# EasyEDA Pro project ProPrj_四路电机电源板_2025-10-18.epro

# Schematic Schematic1
Board Name: Board1; Create Date: 2025-07-10; Page Name: P1; Project Name: 四路电机电源板; Schematic Name: Schematic1; Update Date: 2025-07-10; Company: 嘉立创EDA; Page Size: A4; Version: V1.0
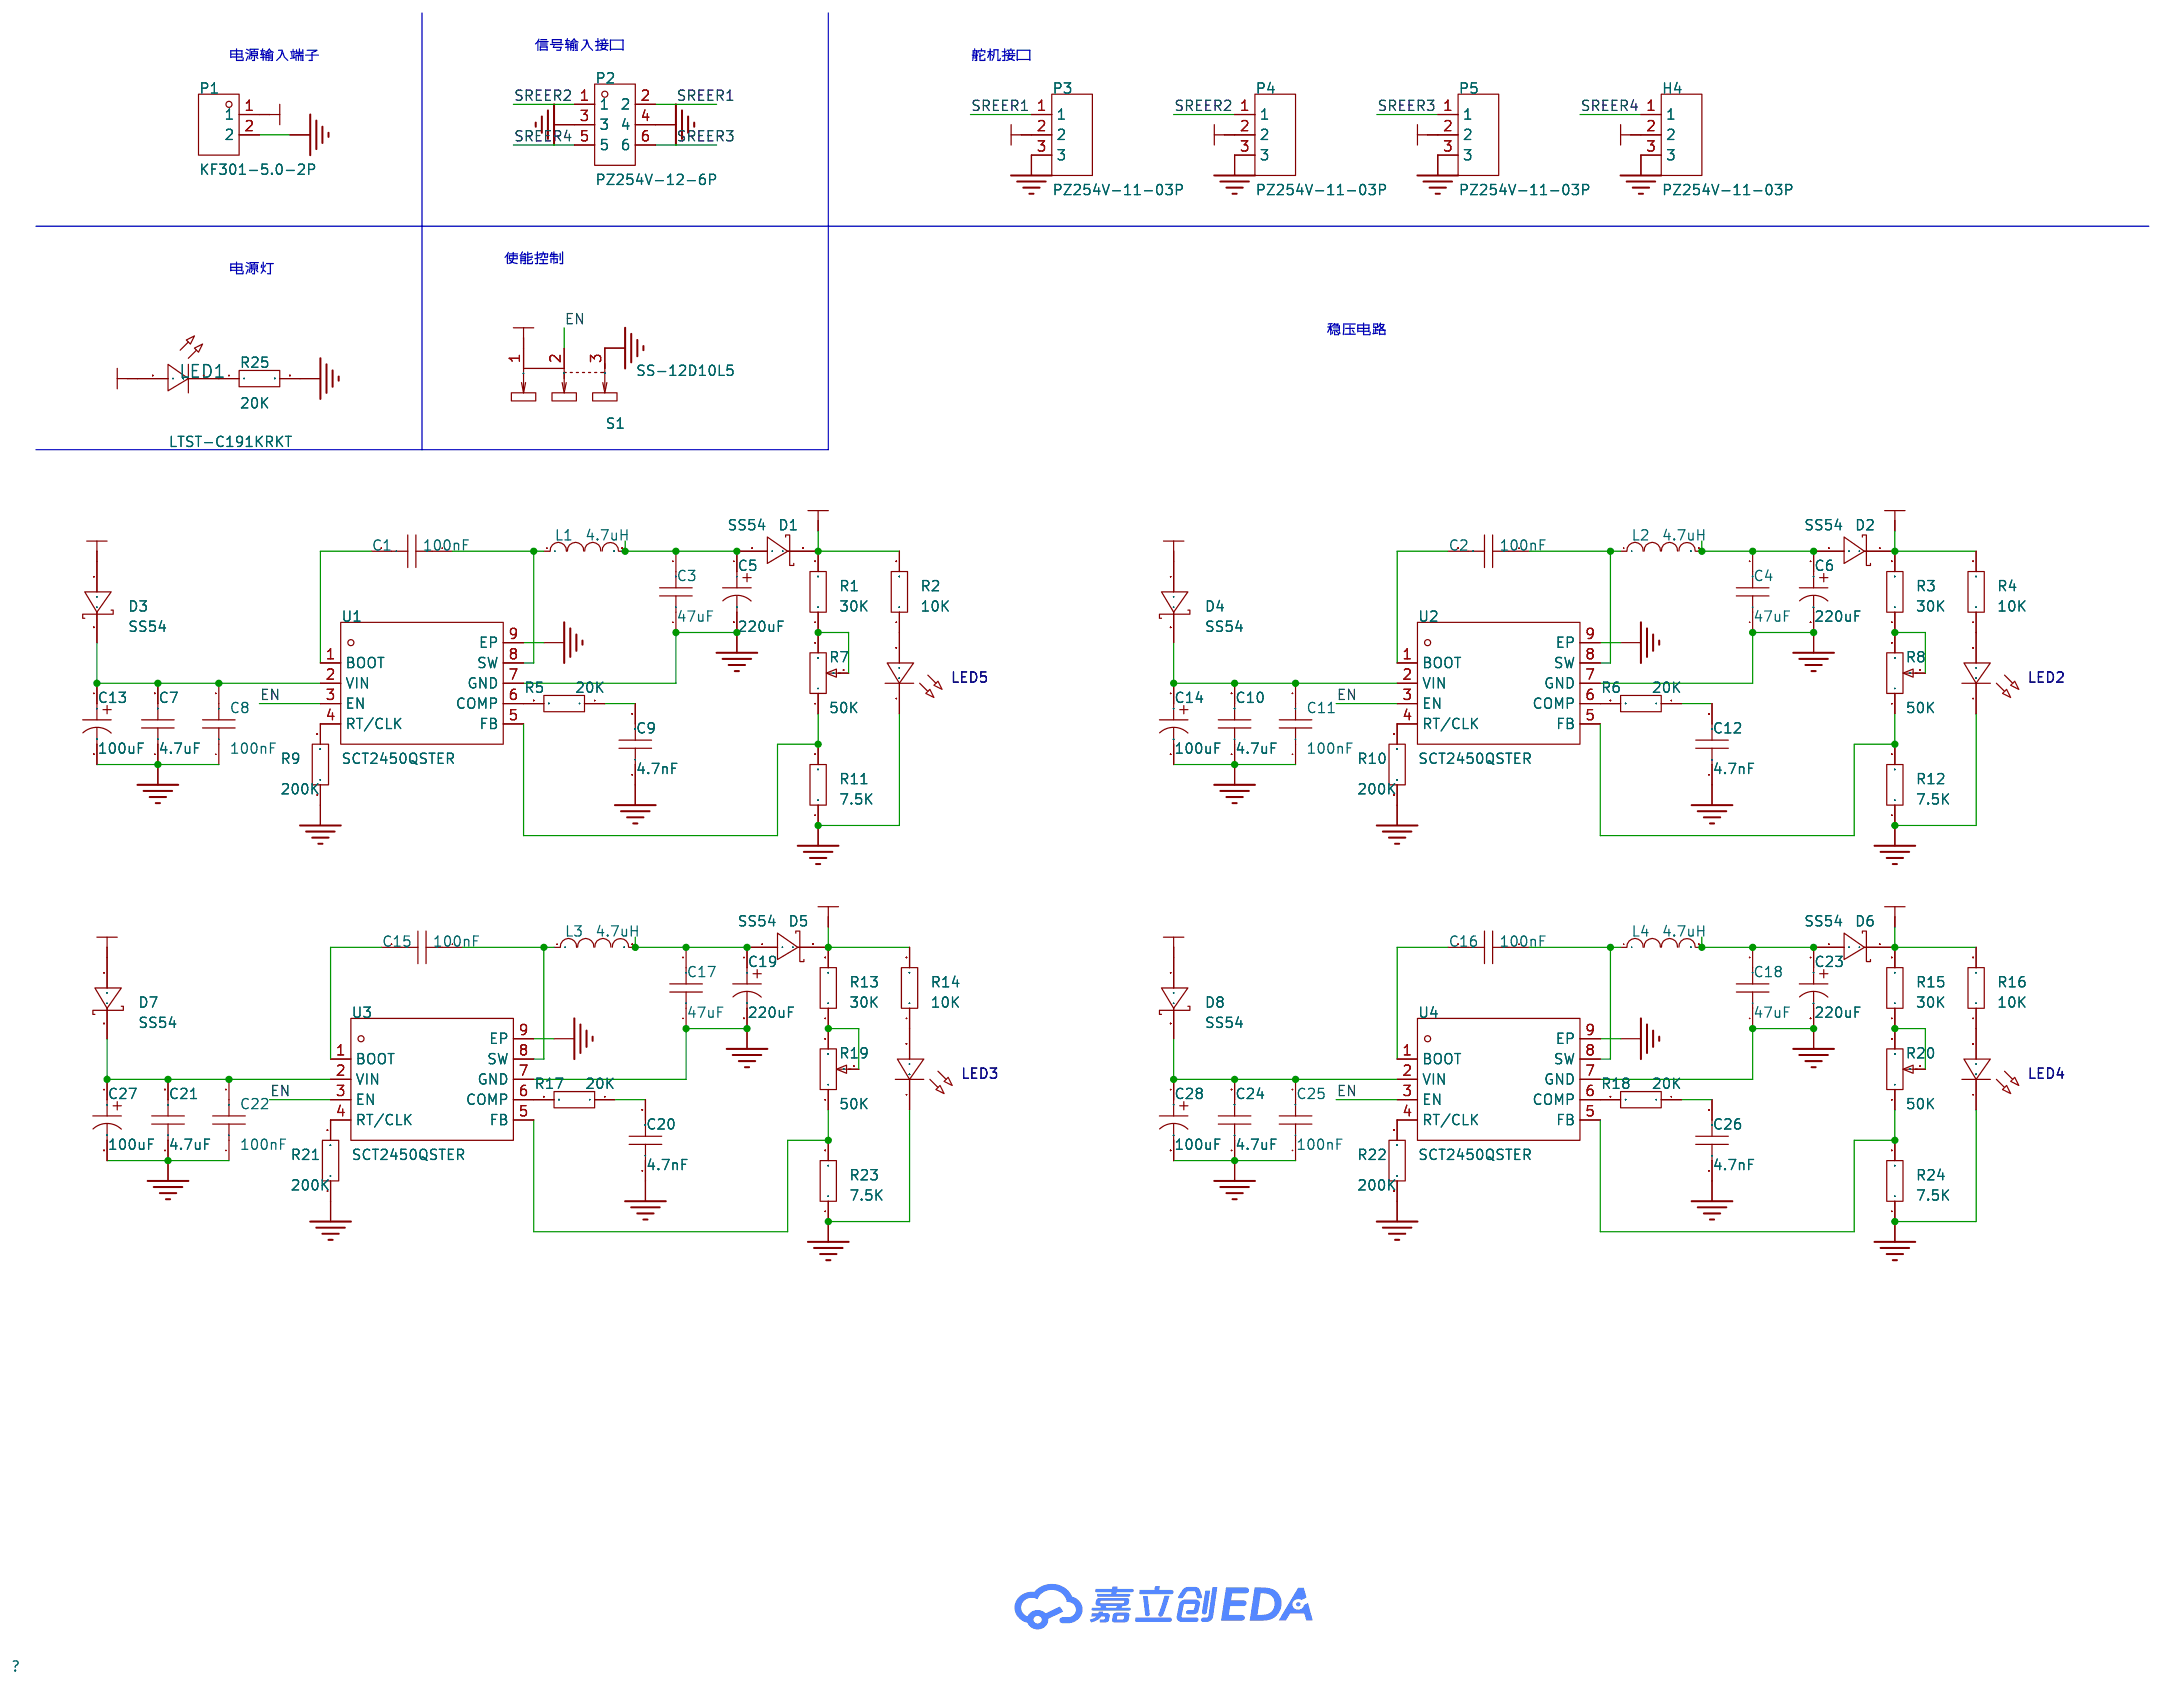
[diagram p0: schematic sheet]

## Parts
C1  100nF  [C0603]
C2  100nF  [C0603]
C3  47uF  [C1206]
C4  47uF  [C1206]
C5  220uF  [CAP-SMD_BD6.3-L6.6-W6.6-LS7.2-FD]
C6  220uF  [CAP-SMD_BD6.3-L6.6-W6.6-LS7.2-FD]
C7  4.7uF  [C1206]
C8  100nF  [C0603]
C9  4.7nF  [C0603]
C10  4.7uF  [C1206]
C11  100nF  [C0603]
C12  4.7nF  [C0603]
C13  100uF  [CAP-SMD_BD6.3-L6.6-W6.6-LS7.3-FD]
C14  100uF  [CAP-SMD_BD6.3-L6.6-W6.6-LS7.3-FD]
C15  100nF  [C0603]
C16  100nF  [C0603]
C17  47uF  [C1206]
C18  47uF  [C1206]
C19  220uF  [CAP-SMD_BD6.3-L6.6-W6.6-LS7.2-FD]
C20  4.7nF  [C0603]
C21  4.7uF  [C1206]
C22  100nF  [C0603]
C23  220uF  [CAP-SMD_BD6.3-L6.6-W6.6-LS7.2-FD]
C24  4.7uF  [C1206]
C25  100nF  [C0603]
C26  4.7nF  [C0603]
C27  100uF  [CAP-SMD_BD6.3-L6.6-W6.6-LS7.3-FD]
C28  100uF  [CAP-SMD_BD6.3-L6.6-W6.6-LS7.3-FD]
D1  SS54  [SMA_L4.4-W2.8-LS5.4-R-RD]
D2  SS54  [SMA_L4.4-W2.8-LS5.4-R-RD]
D3  SS54  [SMA_L4.4-W2.8-LS5.4-R-RD]
D4  SS54  [SMA_L4.4-W2.8-LS5.4-R-RD]
D5  SS54  [SMA_L4.4-W2.8-LS5.4-R-RD]
D6  SS54  [SMA_L4.4-W2.8-LS5.4-R-RD]
D7  SS54  [SMA_L4.4-W2.8-LS5.4-R-RD]
D8  SS54  [SMA_L4.4-W2.8-LS5.4-R-RD]
H4  PZ254V-11-03P  [HDR-TH_3P-P2.54-V-M]
L1  4.7uH  [IND-SMD_L5.4-W5.2_FXL0530]
L2  4.7uH  [IND-SMD_L5.4-W5.2_FXL0530]
L3  4.7uH  [IND-SMD_L5.4-W5.2_FXL0530]
L4  4.7uH  [IND-SMD_L5.4-W5.2_FXL0530]
LED1  LTST-C191KRKT  [LED_0603]
LED2  -  [LED_0805]
LED3  -  [LED_0805]
LED4  -  [LED_0805]
LED5  -  [LED_0805]
P1  KF301-5.0-2P  [CONN-TH_P5.00_KF301-5.0-2P]
P2  PZ254V-12-6P  [HDR-TH_6P-P2.54-V-M-R2-C3-S2.54]
P3  PZ254V-11-03P  [HDR-TH_3P-P2.54-V-M]
P4  PZ254V-11-03P  [HDR-TH_3P-P2.54-V-M]
P5  PZ254V-11-03P  [HDR-TH_3P-P2.54-V-M]
R1  30K  [R0805]
R2  10K  [R0805]
R3  30K  [R0805]
R4  10K  [R0805]
R5  20K  [R0805]
R6  20K  [R0805]
R7  50K  [R_3386P]
R8  50K  [R_3386P]
R9  200K  [R0805]
R10  200K  [R0805]
R11  7.5K  [R0805]
R12  7.5K  [R0805]
R13  30K  [R0805]
R14  10K  [R0805]
R15  30K  [R0805]
R16  10K  [R0805]
R17  20K  [R0805]
R18  20K  [R0805]
R19  50K  [R_3386P]
R20  50K  [R_3386P]
R21  200K  [R0805]
R22  200K  [R0805]
R23  7.5K  [R0805]
R24  7.5K  [R0805]
R25  20K  [R0805]
S1  SS-12D10L5  [SW-TH_SS-12D10L5]
U1  SCT2450QSTER  [ESOP-8_L4.9-W3.9-P1.27-LS6.0-BL-EP]
U2  SCT2450QSTER  [ESOP-8_L4.9-W3.9-P1.27-LS6.0-BL-EP]
U3  SCT2450QSTER  [ESOP-8_L4.9-W3.9-P1.27-LS6.0-BL-EP]
U4  SCT2450QSTER  [ESOP-8_L4.9-W3.9-P1.27-LS6.0-BL-EP]

## Library data of the parts
C1 C2 C8 C11 C15 C16 C22 C25 = CGA0603X7R104K500JT: 容值:100nF;精度:±10%;额定电压:50V;温度系数:X7R;; LCSC Part Name: 100nF ±10% 50V; Supplier Part: C6119867; Manufacturer: HRE(芯声); Supplier Footprint: 0603; JLCPCB Part Class: Extended Part; Datasheet: https://atta.szlcsc.com/upload/public/pdf/source/20250103/C44077DA9E7B3EFAE02F22B6D3D1CBC9.pdf; Supplier: LCSC; Tolerance: ±10%; Voltage Rating: 50V; Temperature Coefficient: X7R
C3 C4 C17 C18 = HGC1206R5476M250NSPJ: 容值:47uF;精度:±20%;额定电压:25V;温度系数:X5R;; LCSC Part Name: 47uF ±20% 25V; Supplier Part: C22367835; Manufacturer: Chinocera(华瓷); Supplier Footprint: 1206; JLCPCB Part Class: Extended Part; Datasheet: https://atta.szlcsc.com/upload/public/pdf/source/20240326/E6CB0DC43BB858B74F4352229FABFDCA.pdf; Supplier: LCSC; Tolerance: ±20%; Voltage Rating: 25V; Temperature Coefficient: X5R
C5 C6 C19 C23 = FD1E221M0810: 容值:220uF;精度:±20%;额定电压:25V;纹波电流:600mA@100KHz;等效串联电阻(ESR):160mΩ@100kHz;; LCSC Part Name: 220uF ±20% 25V; Supplier Part: C47379847; Manufacturer: ChengTao(诚韬); Supplier Footprint: SMD,D8xL10.5mm; JLCPCB Part Class: Extended Part; Datasheet: https://atta.szlcsc.com/upload/public/pdf/source/20250515/A73FDEF460773D8B851F61DBE50F66F2.pdf; Supplier: LCSC; Tolerance: ±20%; Voltage Rating: 25V; Ripple Current: 600mA@100KHz; Equivalent Series Resistance(ESR): 160mΩ@100kHz; Diameter: 8mm; Height - Seated (Max): 10.5mm; Lifetime: 2000hrs@105℃; Operating Temperature: -55℃~+105℃
C7 C10 C21 C24 = CL31B475KBHNNNE: 容值:4.7uF;精度:±10%;额定电压:50V;材质(温度系数):X7R;; LCSC Part Name: 4.7uF ±10% 50V; Supplier Part: C51205; Manufacturer: SAMSUNG(三星); Supplier Footprint: 1206; JLCPCB Part Class: Extended Part; Datasheet: https://atta.szlcsc.com/upload/public/pdf/source/20160218/1457707763339.pdf; Supplier: LCSC; Tolerance: ±10%; Voltage Rated: 50V; Temperature Coefficient: X7R
C9 C12 C20 C26 = CGA0603X7R472K500JT: 容值:4.7nF;精度:±10%;额定电压:50V;温度系数:X7R;; LCSC Part Name: 4.7nF ±10% 50V; Supplier Part: C7503499; Manufacturer: HRE(芯声); Supplier Footprint: 0603; JLCPCB Part Class: Extended Part; Supplier: LCSC; Tolerance: ±10%; Voltage Rating: 50V; Temperature Coefficient: X7R
C13 C14 C27 C28 = MA25V100M6x6: 容值:100uF;精度:±20%;额定电压:25V;纹波电流:2.65A@100kHz;等效串联电阻(ESR):30mΩ@100kHz;类型:聚合物;; LCSC Part Name: 100uF ±20% 25V; Supplier Part: C46550465; Manufacturer: 捷而瑞; Supplier Footprint: SMD,D6.3xL6mm; JLCPCB Part Class: Extended Part; Datasheet: https://atta.szlcsc.com/upload/public/pdf/source/20250527/0775B60C79545A62B473432786128FCC.pdf; Supplier: LCSC; Tolerance: ±20%; Voltage Rating: 25V; Ripple Current: 2.65A@100kHz; Equivalent Series Resistance(ESR): 30mΩ@100kHz; Type: 聚合物; Diameter: 6.3mm; Height - Seated (Max): 6mm; Lifetime: 2000hrs@105℃; Operating Temperature: -55℃~+105℃
D1-D8 = SS54_C22452: 二极管配置:独立式;正向压降(Vf):550mV@5A;直流反向耐压(Vr):40V;整流电流:5A;; LCSC Part Name: 电压:40V 电流:5A; Supplier Part: C22452; Manufacturer: MDD(辰达半导体); Supplier Footprint: SMA(DO-214AC); JLCPCB Part Class: 基础库; Datasheet: https://atta.szlcsc.com/upload/public/pdf/source/20240710/73DFBB65C1883B895E62D589679033DF.pdf; Supplier: LCSC; Diode Configuration: 独立式; Forward Voltage (Vf@If): 550mV@5A; Reverse Voltage (Vr): 40V; Rectified Current: 5A; Reverse Leakage Current (Ir): 1mA@40V
H4 P3-P5 = PZ254V-11-03P: 插针结构:1x3P;间距:2.54mm;行距:-;圆针/方针:方针;安装方式:直插;排数:单排;总PIN位数:3P;额定电流:3A;额定电压:250V;配合针长度:6mm;塑高:2.5mm;端接针长度:3mm;工作温度:-40℃~+105℃;颜色:黑色;; LCSC Part Name: 1x3P 间距:2.54mm 方针 直插; Supplier Part: C2937625; Manufacturer: XFCN(兴飞); Supplier Footprint: 插件,P=2.54mm; JLCPCB Part Class: 扩展库; Datasheet: https://atta.szlcsc.com/upload/public/pdf/source/20200309/C492402_8335C3D49C4E4C618838D59BB1D024C1.pdf; Supplier: LCSC; Pin Structure: 1x3P; Pitch: 2.54mm; Circluar Pins/Square Pins: 方针; Mounting Type: 直插; Number of Rows: 单排; Number of Pins: 3P; Current Rating: 3A; Voltage Rating (Max): 250V; Length of Mating Pin: 6mm; Insulation Height: 2.5mm; Length of End Connection Pin: 3mm; Operating Temperature: -40℃~+105℃; Color: 黑色
L1-L4 = FXL0530-4R7-M: 电感值:4.7uH;精度:±20%;额定电流:4.5A;饱和电流(Isat):5A;类型:一体成型电感;; LCSC Part Name: 4.7uH ±20% 5A; Supplier Part: C177246; Manufacturer: cjiang(长江微电); Supplier Footprint: SMD,5.2x5.4mm; JLCPCB Part Class: Extended Part; Datasheet: https://atta.szlcsc.com/upload/public/pdf/source/20240426/3189EA8206330E2108542F9E34E540E7.pdf; Supplier: LCSC; Tolerance: ±20%; Rated Current: 4.5A; Saturation Current (Isat): 5A; DC Resistance (DCR): 60mΩ; Type: 一体成型电感
LED1 = LTST-C191KRKT: 发光颜色:红色;正向电压(VF):2V;功率:75mW;正向电流:20mA;主波长:631nm;二极管配置:-;透镜颜色:无色透明透镜;色温:-;发光强度:54mcd;发光角度:130°;载带方式:-;工作温度:-55℃~+85℃;; LCSC Part Name: 红灯; Supplier Part: C125099; Manufacturer: LITEON(光宝); Supplier Footprint: 0603; JLCPCB Part Class: Extended Part; Datasheet: https://atta.szlcsc.com/upload/public/pdf/source/20180129/C125099_15171878294931315872.pdf; Supplier: LCSC; Emitted Color: 红色; Forward Voltage (VF): 2V; Power Dissipation: 75mW; Forward Current: 20mA; Dominant Wavelength: 631nm; Peak Wavelength: 639nm; Lens Color: 无色透明透镜; Luminous Intensity: 54mcd; Viewing Angle: 130°; Operating Temperature: -55℃~+85℃
LED2-LED5 = LED_0805-G: Supplier Footprint: 0805
P1 = KF301-5.0-2P: 结构:1x2P;间距:5mm;颜色:蓝色;安装方式:直插;额定电流:17A;额定电压:250V;排数:1;线规 - AWG:14~22;线规 - 平方毫米:1.5;每排PIN数:2;工作温度范围:-30℃~+120℃;; LCSC Part Name: 5mm 1x2P 排数:1 每排P数:2 直插; Supplier Part: C474881; Manufacturer: KEFA(科发); Supplier Footprint: 插件,P=5mm; JLCPCB Part Class: 扩展库; Datasheet: https://atta.szlcsc.com/upload/public/pdf/source/20230317/03A5B5FC229D6F9225E8F51DA1A4E80A.pdf; Supplier: LCSC; Structure: 1x2P; Pitch: 5mm; Color: 蓝色; Mounting Style: 直插; Current Rating (Max): 17A; Voltage Rating (Max): 250V; Number of Pins: 2P; Number of Rows: 1; Wire Gauge - AWG: 14~22; Wire Gauge - mm2: 1.5; Number of PINs Per Row: 2; Operating Temperature Range: -30℃~+120℃
P2 = PZ254V-12-6P: 插针结构:2x3P;间距:2.54mm;行距:2.54mm;圆针/方针:方针;安装类型:直插;排数:双排;总PIN位数:6P;额定电流:-;额定电压:-;配合针长度:6mm;塑高:2.5mm;端接针长度:3mm;触头材质:黄铜;触头镀层:-;工作温度范围:-40℃~+105℃;颜色:黑色;; LCSC Part Name: 间距:2.54mm 2x3P 直插 方针; Supplier Part: C492420; Manufacturer: XFCN(兴飞); Supplier Footprint: 插件,P=2.54mm; JLCPCB Part Class: 扩展库; Datasheet: https://atta.szlcsc.com/upload/public/pdf/source/20200309/C492420_BAECB307B001054C09D200388220EAE6.pdf; Supplier: LCSC; Pin Structure: 2x3P; Pitch: 2.54mm; Row Spacing: 2.54mm; Circluar Pins/Square Pins: 方针; Mounting Type: 直插; Number of Rows: 双排; Number of Pins: 6P; Length of Mating Pin: 6mm; Insulation Height: 2.5mm; Length of End Connection Pin: 3mm; Contact Material: 黄铜; Operating Temperature Range: -40℃~+105℃; Color: 黑色
R1-R6 R9-R18 R21-R25 = Res_0805: Supplier Footprint: 0805
R7 R8 R19 R20 = R_3386P: Supplier Footprint: 直插
S1 = SS-12D10L5: 电路结构:单刀双掷;安装方式:直插;开关颜色:黑色;额定电流(DC):3A;额定电压(DC):125V;额定电流(AC):3A;额定电压(AC):125V;机械寿命:1万次;; LCSC Part Name: 柄长5mm 直插双档 滑动开关; Supplier Part: C319012; Manufacturer: XKB Connectivity(中国星坤); Supplier Footprint: 插件; JLCPCB Part Class: 扩展库; Datasheet: https://atta.szlcsc.com/upload/public/pdf/source/20211009/D6412F37AABE6F9459A6EE7FA4DAEADB.pdf; Supplier: LCSC; Circuit: 单刀双掷; Actuator Style: 矩形柱状; Pin Style: PC引脚; Switch Length: 13mm; Switch Width: 6.8mm; Switch Height: 6.4mm; Mounting Style: 直插; Actuator Color: 黑色; Current Rating (DC): 3A; Voltage Rating (DC): 125V; Current Rating (AC): 3A; Voltage Rating (AC): 125V; Mechanical Life: 1万次; Operating Temperature: -40℃~+85℃
U1-U4 = SCT2450QSTER: 工作电压:3.8V~36V;输出电流:5A;; LCSC Part Name: 3.8V-36V 输入，5A 输出，高效同步降压DC-DC转换器; Supplier Part: C2929524; Manufacturer: SCT(芯洲科技); Supplier Footprint: ESOP-8; JLCPCB Part Class: 扩展库; Datasheet: https://atta.szlcsc.com/upload/public/pdf/source/20211215/931D8B56C9B2E8CCF51B671F286E63AF.pdf; Supplier: LCSC; Input Voltage: 3.8V~36V; Output Current: 5A; Switching Frequency: 500kHz; Operating Temperature: -40℃~+125℃@(TJ); Synchronous Rectification: 是; Number of Outputs: 1; Switch tube (built-in/external): 内置

## Nets
GND: C3.1 C4.1 C5.2 C6.2 C7.1 C8.1 C9.1 C10.1 C11.1 C12.1 C13.2 C14.2 C17.1 C18.1 C19.2 C20.1 C21.1 C22.1 C23.2 C24.1 C25.1 C26.1 C27.2 C28.2 H4.3 LED2.1(C) LED3.1(C) LED4.1(C) LED5.1(C) P1.2 P2.3 P2.4 P3.3 P4.3 P5.3 R9.1 R10.1 R11.1 R12.1 R21.1 R22.1 R23.1 R24.1 R25.2 S1.3 U1.7(GND) U1.9(EP) U2.7(GND) U2.9(EP) U3.7(GND) U3.9(EP) U4.7(GND) U4.9(EP)
VCCSREER1: D1.2(K) P3.2 R1.2 R2.2
VCCSREER2: D2.2(K) P4.2 R3.2 R4.2
VCCSREER3: D5.2(K) P5.2 R13.2 R14.2
VCCSREER4: D6.2(K) H4.2 R15.2 R16.2
VIN: D3.1(A) D4.1(A) D7.1(A) D8.1(A) LED1.2(A) P1.1 S1.1
EN: S1.2 U1.3(EN) U2.3(EN) U3.3(EN) U4.3(EN)
SREER1: P2.2 P3.1
SREER2: P2.1 P4.1
SREER3: P2.6 P5.1
SREER4: H4.1 P2.5
$1N1529: LED1.1(C) R25.1
$1N2246: C7.2 C8.2 C13.1 D3.2(K) U1.2(VIN)
$1N2398: C1.1 L1.1 U1.8(SW)
$1N2414: C1.2 U1.1(BOOT)
$1N2467: C3.2 C5.1 D1.1(A) L1.2
$1N2570: R9.2 U1.4(RT/CLK)
$1N2627: C9.2 R5.1
$1N2629: R5.2 U1.6(COMP)
$1N2753: LED5.2(A) R2.1
$1N2844: R7.1 R11.2 U1.5(FB)
$1N2877: R1.1 R7.2 R7.3
$1N4066: R8.1 R12.2 U2.5(FB)
$1N4075: LED2.2(A) R4.1
$1N4077: R3.1 R8.2 R8.3
$1N4088: C4.2 C6.1 D2.1(A) L2.2
$1N4093: C10.2 C11.2 C14.1 D4.2(K) U2.2(VIN)
$1N4098: C2.1 L2.1 U2.8(SW)
$1N4105: C2.2 U2.1(BOOT)
$1N4108: R10.2 U2.4(RT/CLK)
$1N4117: C12.2 R6.1
$1N4119: R6.2 U2.6(COMP)
$1N4793: C17.2 C19.1 D5.1(A) L3.2
$1N4803: C20.2 R17.1
$1N4807: C15.1 L3.1 U3.8(SW)
$1N4815: C21.2 C22.2 C27.1 D7.2(K) U3.2(VIN)
$1N4820: R21.2 U3.4(RT/CLK)
$1N4822: C15.2 U3.1(BOOT)
$1N4825: R19.1 R23.2 U3.5(FB)
$1N4831: R17.2 U3.6(COMP)
$1N4840: LED3.2(A) R14.1
$1N4845: R13.1 R19.2 R19.3
$1N6216: R15.1 R20.2 R20.3
$1N6219: R20.1 R24.2 U4.5(FB)
$1N6228: LED4.2(A) R16.1
$1N6236: C18.2 C23.1 D6.1(A) L4.2
$1N6243: C16.1 L4.1 U4.8(SW)
$1N6250: C26.2 R18.1
$1N6252: R18.2 U4.6(COMP)
$1N6254: C24.2 C25.2 C28.1 D8.2(K) U4.2(VIN)
$1N6266: R22.2 U4.4(RT/CLK)
$1N6271: C16.2 U4.1(BOOT)

## Notes on the sheet
- 电源输入端子
- 信号输入接口
- 舵机接口
- 电源灯
- 使能控制
- 稳压电路

# Board PCB1
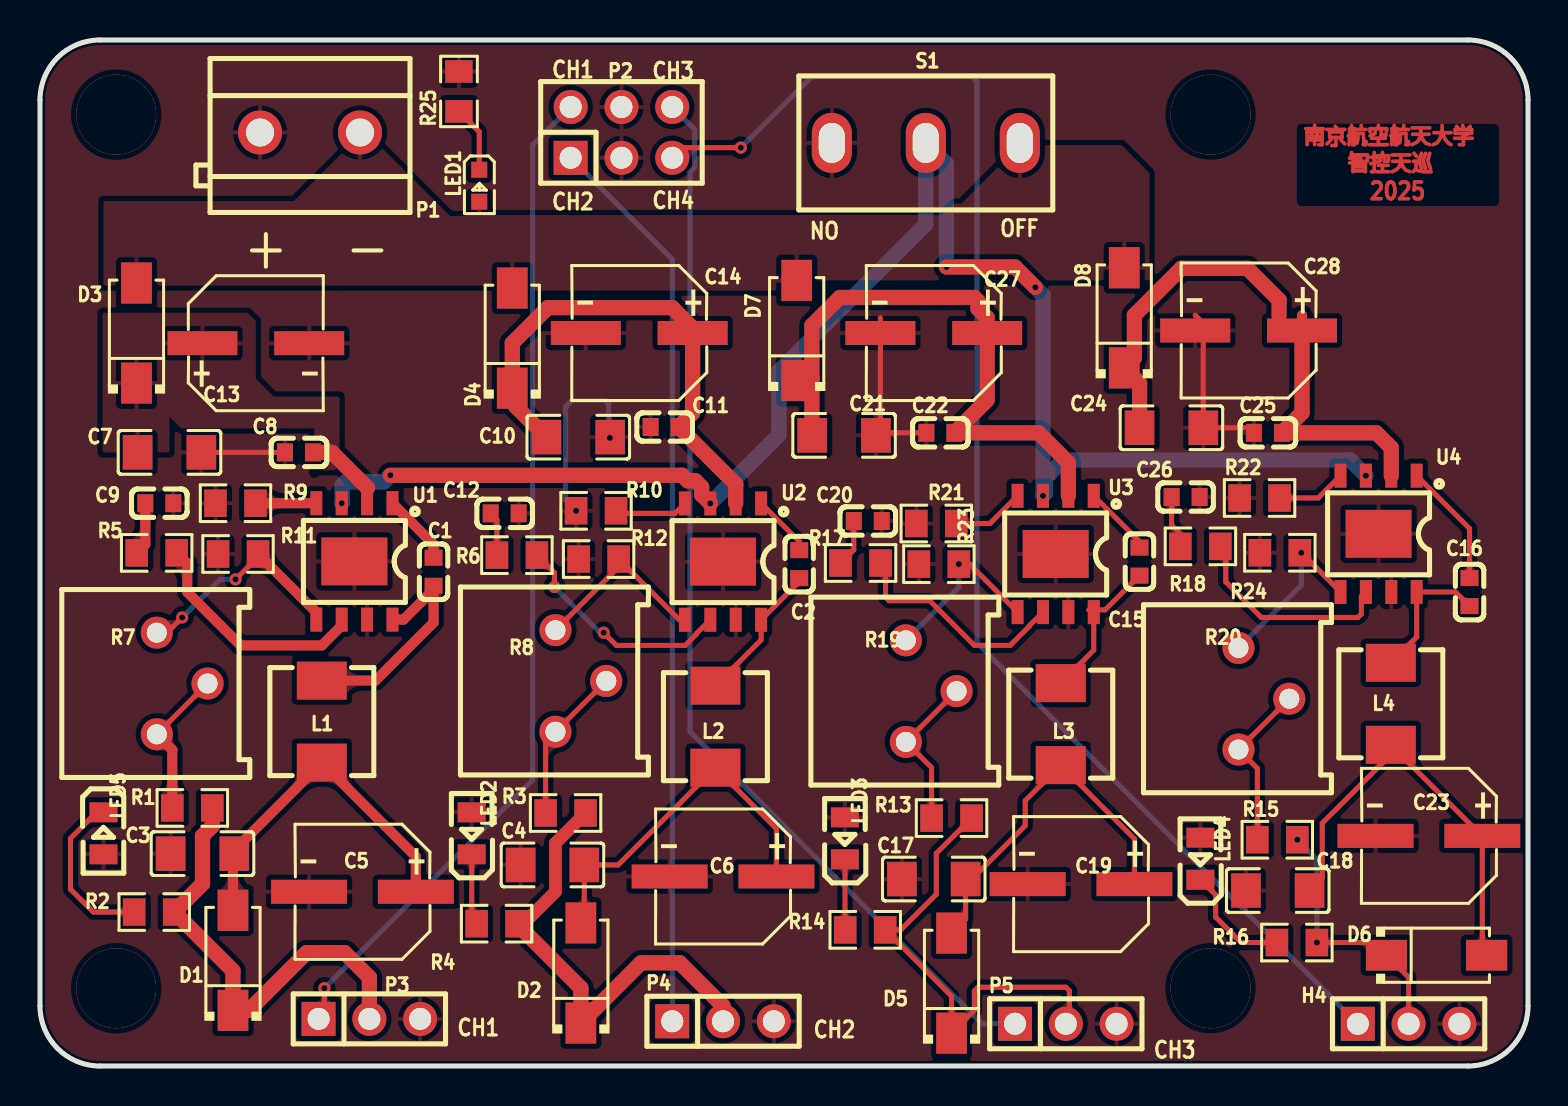
[diagram p1: board, top side]
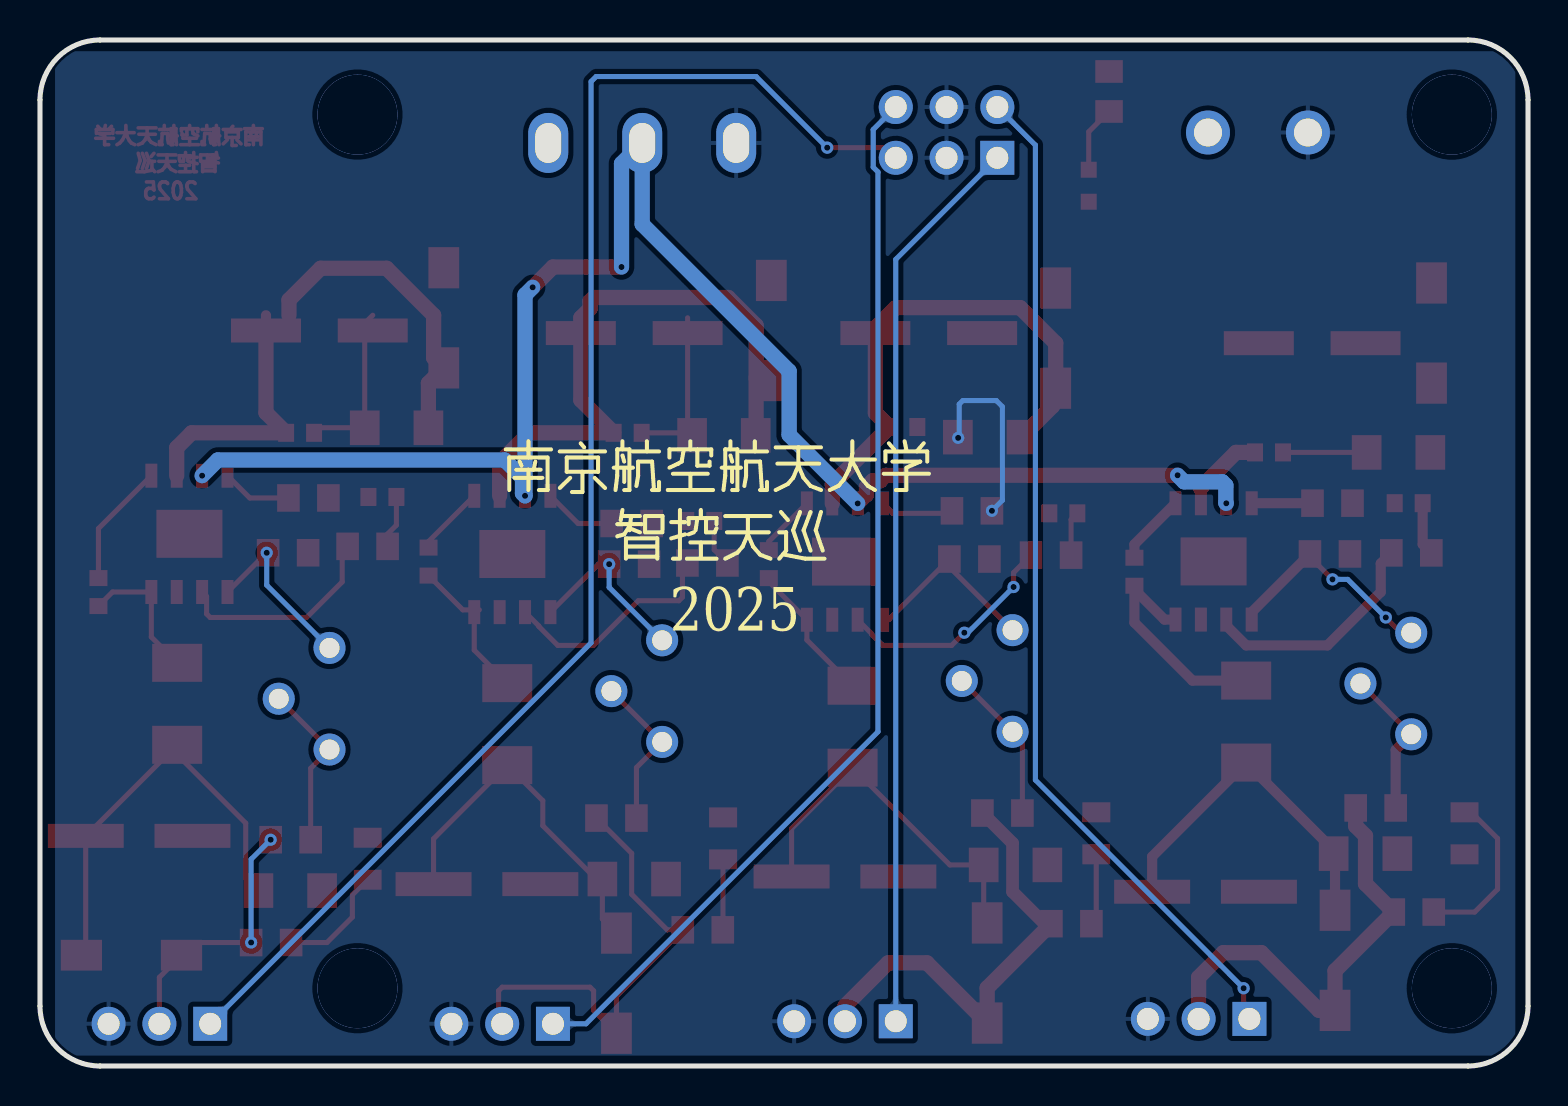
[diagram p2: board, bottom side, seen from below]

Outline 74.43 x 51.31 mm; copper layers: Top Layer, Bottom Layer. Coordinates in mm from the lower left corner of the outline.
Outline path: 0,48.31 0,3 arc(0.88,0.88) 3,0 71.43,0 arc(73.55,0.88) 74.43,3 74.43,48.31 arc(73.55,50.43) 71.43,51.31 3,51.31 arc(0.88,50.43) 0,48.31
Stack: Top Layer 0.035mm / Dielectric1 1.51mm FR4 er 4.5 / Bottom Layer 0.035mm

## Design rules (mm)
template: JLCPCB Capability(Two Layers Board)
spacing copperThickness1oz (default): track to track 0.102, other pairs 0.152 to 0.3
spacing copperThickness2oz: track to track 0.203, other pairs 0.152 to 0.3
track width copperThickness1oz (default): min 0.127, default 0.254, max 2.54
track width copperThickness2oz: min 0.203, default 0.254, max 2.54
differential pair differentialPair (default): width min 0.127, default 0.254, max 2.54; gap min 0.152, default 0.152
via viaSize (default): diameter min 0.5, default 0.61, max 10; hole min 0.3, default 0.305, max 6.3

## Placement (name value [footprint] x y rotation side)
C1  100nF  [C0603]  19.69 24.72 90 top
C2  100nF  [C0603]  37.97 25.1 90 top
C3  47uF  [C1206]  8.13 10.62 0 top
C4  47uF  [C1206]  25.63 10.05 0 top
C5  220uF  [CAP-SMD_BD6.3-L6.6-W6.6-FD-1]  16.13 8.71 180 top
C6  220uF  [CAP-SMD_BD6.3-L6.6-W6.6-FD-1]  34.16 9.48 180 top
C7  4.7uF  [C1206]  6.48 30.69 180 top
C8  100nF  [C0603]  12.95 30.69 0 top
C9  4.7nF  [C0603]  5.97 28.15 180 top
C10  4.7uF  [C1206]  26.92 31.45 180 top
C11  100nF  [C0603]  31.24 31.96 0 top
C12  4.7nF  [C0603]  23.24 27.64 180 top
C13  100uF  [CAP-SMD_BD6.3-L6.6-W6.6-LS7.3-FD]  10.8 36.15 0 top
C14  100uF  [CAP-SMD_BD6.3-L6.6-W6.6-LS7.3-FD]  29.97 36.65 180 top
C15  100nF  [C0603]  54.99 25.22 90 top
C16  100nF  [C0603]  71.5 23.7 90 top
C17  47uF  [C1206]  44.7 9.35 0 top
C18  47uF  [C1206]  61.91 8.77 0 top
C19  220uF  [CAP-SMD_BD6.3-L6.6-W6.6-FD-1]  52.07 9.1 180 top
C20  4.7nF  [C0603]  41.4 27.26 180 top
C21  4.7uF  [C1206]  40.22 31.54 180 top
C22  100nF  [C0603]  45.03 31.66 0 top
C23  220uF  [CAP-SMD_BD6.3-L6.6-W6.6-FD-1]  69.47 11.51 180 top
C24  4.7uF  [C1206]  56.59 31.92 180 top
C25  100nF  [C0603]  61.42 31.66 0 top
C26  4.7nF  [C0603]  57.3 28.46 180 top
C27  100uF  [CAP-SMD_BD6.3-L6.6-W6.6-LS7.3-FD]  44.7 36.65 180 top
C28  100uF  [CAP-SMD_BD6.3-L6.6-W6.6-LS7.3-FD]  60.45 36.78 180 top
D1  SS54  [SMA_L4.4-W2.8-LS5.4-R-RD]  9.65 5.29 90 top
D2  SS54  [SMA_L4.4-W2.8-LS5.4-R-RD]  27.05 4.65 90 top
D3  SS54  [SMA_L4.4-W2.8-LS5.4-R-RD]  4.83 36.65 90 top
D4  SS54  [SMA_L4.4-W2.8-LS5.4-R-RD]  23.62 36.4 90 top
D5  SS54  [SMA_L4.4-W2.8-LS5.4-R-RD]  45.59 4.14 90 top
D6  SS54  [SMA_L4.4-W2.8-LS5.4-R-RD]  69.85 5.54 0 top
D7  SS54  [SMA_L4.4-W2.8-LS5.4-R-RD]  37.85 36.78 90 top
D8  SS54  [SMA_L4.4-W2.8-LS5.4-R-RD]  54.23 37.42 90 top
H4  PZ254V-11-03P  [HDR-TH_3P-P2.54-V-M]  68.45 2.11 0 top
L1  4.7uH  [IND-SMD_L5.4-W5.2_FXL0530]  14.1 17.22 270 top
L2  4.7uH  [IND-SMD_L5.4-W5.2_FXL0530]  33.78 16.97 270 top
L3  4.7uH  [IND-SMD_L5.4-W5.2_FXL0530]  51.05 17.1 270 top
L4  4.7uH  [IND-SMD_L5.4-W5.2_FXL0530]  67.56 18.11 270 top
LED1  LTST-C191KRKT  [LED0603-RD]  21.97 44.02 270 top
LED2  KT-0805G  [LED0805-R-RD]  21.59 11.64 90 top
LED3  KT-0805G  [LED0805-R-RD]  40.26 11.38 90 top
LED4  KT-0805G  [LED0805-R-RD]  58.04 10.37 90 top
LED5  KT-0805G  [LED0805-R-RD]  3.17 11.64 270 top
P1  KF301-5.0-2P  [CONN-TH_P5.00_KF301-5.0-2P]  13.51 46.68 180 top
P2  PZ254V-12-6P  [HDR-TH_6P-P2.54-V-M-R2-C3-S2.54]  29.08 46.69 0 top
P3  PZ254V-11-03P  [HDR-TH_3P-P2.54-V-M]  16.48 2.36 0 top
P4  PZ254V-11-03P  [HDR-TH_3P-P2.54-V-M]  34.16 2.24 0 top
P5  PZ254V-11-03P  [HDR-TH_3P-P2.54-V-M]  51.31 2.11 0 top
R1  30K  [R0805]  7.62 12.91 0 top
R2  10K  [R0805]  5.72 7.7 0 top
R3  30K  [R0805]  26.29 12.65 0 top
R4  10K  [R0805]  22.84 7.12 0 top
R5  20K  [R0805]  5.84 25.66 0 top
R6  20K  [R0805]  23.85 25.55 0 top
R7  50K  [RES-ADJ-TH_3P-L9.5-W9.5-P2.54-BR-BS]  7.11 19.13 180 top
R8  50K  [RES-ADJ-TH_3P-L9.5-W9.5-P2.54-BR-BS]  27.05 19.26 180 top
R9  200K  [R0805]  9.78 28.15 0 top
R10  200K  [R0805]  27.81 27.76 0 top
R11  7.5K  [R0805]  9.91 25.61 0 top
R12  7.5K  [R0805]  27.94 25.35 0 top
R13  30K  [R0805]  45.59 12.4 0 top
R14  10K  [R0805]  41.28 6.81 0 top
R15  30K  [R0805]  61.89 11.32 0 top
R16  10K  [R0805]  62.87 6.17 0 top
R17  20K  [R0805]  41.04 25.15 0 top
R18  20K  [R0805]  58.04 25.99 0 top
R19  50K  [RES-ADJ-TH_3P-L9.5-W9.5-P2.54-BR-BS]  44.58 18.75 180 top
R20  50K  [RES-ADJ-TH_3P-L9.5-W9.5-P2.54-BR-BS]  61.21 18.37 180 top
R21  200K  [R0805]  44.83 27.13 0 top
R22  200K  [R0805]  61 28.41 0 top
R23  7.5K  [R0805]  44.96 25.1 0 top
R24  7.5K  [R0805]  62.01 25.67 0 top
R25  20K  [R0805]  20.96 48.74 90 top
S1  SS-12D10L5  [SW-TH_SS-12D10L5]  44.3 46.16 180 top
U1  SCT2450QSTER  [ESOP-8_L4.9-W3.9-P1.27-LS6.0-BL-EP]  15.73 25.23 180 top
U2  SCT2450QSTER  [ESOP-8_L4.9-W3.9-P1.27-LS6.0-BL-EP]  34.16 25.22 180 top
U3  SCT2450QSTER  [ESOP-8_L4.9-W3.9-P1.27-LS6.0-BL-EP]  50.8 25.61 180 top
U4  SCT2450QSTER  [ESOP-8_L4.9-W3.9-P1.27-LS6.0-BL-EP]  66.95 26.61 180 top

## Footprints (pads in the part's own frame, mm; a bottom-side part is the same pattern mirrored in y, then rotated)
C0603
  rect 0.8x0.9 smd: 1(-0.7,0) 2(0.7,0)
C1206
  rect 1.485x1.728 smd: 1(-1.593,0) 2(1.593,0)
CAP-SMD_BD6.3-L6.6-W6.6-FD-1
  rect 3.8x1.2 smd: 1(-2.67,0) 2(2.67,0)
CAP-SMD_BD6.3-L6.6-W6.6-LS7.3-FD
  rect 3.5x1.2 smd: 1(-2.67,0) 2(2.67,0)
CONN-TH_P5.00_KF301-5.0-2P
  round 2.2 hole 1.4: 1(-2.5,0) 2(2.5,0)
ESOP-8_L4.9-W3.9-P1.27-LS6.0-BL-EP
  rect 0.6x1.2 smd: 1(-1.905,-2.909) 2(-0.635,-2.909) 3(0.635,-2.909) 4(1.905,-2.909) 5(1.905,2.909) 6(0.635,2.909) 7(-0.635,2.909) 8(-1.905,2.909)
  rect 3.3x2.4 smd: 9(0,0)
HDR-TH_3P-P2.54-V-M
  rect 1.7x1.7 hole 1.1: 1(-2.54,0)
  round 1.7 hole 1.1: 2(0,0) 3(2.54,0)
HDR-TH_6P-P2.54-V-M-R2-C3-S2.54
  rect 1.7x1.7 hole 1.1: 1(-2.54,-1.27)
  round 1.7 hole 1.1: 2(-2.54,1.27) 3(0,-1.27) 4(0,1.27) 5(2.54,-1.27) 6(2.54,1.27)
IND-SMD_L5.4-W5.2_FXL0530
  rect 1.9x2.5 smd: 1(-2.05,0) 2(2.05,0)
LED0603-RD
  rect 0.8x0.8 smd: 1(-0.799,0) 2(0.799,0)
LED0805-R-RD
  rect 1x1.399 smd: 1(1.05,0) 2(-1.05,0)
R0805
  rect 1.133x1.377 smd: 1(-1,0) 2(1,0)
RES-ADJ-TH_3P-L9.5-W9.5-P2.54-BR-BS
  round 1.6 hole 1: 1(1.27,-2.54) 2(-1.27,0) 3(1.27,2.54)
SMA_L4.4-W2.8-LS5.4-R-RD
  rect 2.062x1.539 smd: 1(2.503,0) 2(-2.503,0)
SW-TH_SS-12D10L5
  oval 2x3 hole 1.3x2: 1(-4.7,0) 2(0,0) 3(4.7,0)

## Nets
As in the schematic.

## Via types
v1: diameter 4, hole 4, Top Layer to Bottom Layer, 4 vias
v2: diameter 0.61, hole 0.305, Top Layer to Bottom Layer, 19 vias

## Routing (per net, layer and track width the routed paths; a pad name or vN(x,y) marks a point on that pad's centre or on a via; arc(x,y) is an arc through that point)
GND: length 30.5
  Top Layer w0.254: C22.1 41.94,31.66 ; 41.94,31.66 42.03,31.76 C27.2 42.03,37.42 ; 41.94,31.66 C21.1 ; C7.1 C8.1 ; 57.78,37.54 58.18,37.14 C24.1 60.46,31.92 C25.1
  Bottom Layer w0.254: v2(28.5,31.41) 28.45,31.47 28.45,33.1 28.27,33.28 26.6,33.28 26.29,32.97 26.29,28.29 v2(26.81,27.76)
VCCSREER1: length 22.7
  Top Layer w0.762: P3.2 16.48,4.43 15.24,5.67 13.33,5.67 10.45,2.78 D1.2 9.65,4.76 R2.2 8.13,9.11 8.13,11.51 8.62,12 R1.2
VCCSREER2: length 23.5
  Top Layer w0.635: R4.2 24.18,7.12 25.78,8.71 25.78,11.14 R3.2
  Top Layer w0.762: R4.2 27.05,3.9 D2.2 30.06,5.16 32,5.16 34.16,3 P4.2
VCCSREER3: length 23.6
  Top Layer w0.254: R13.2 44.83,10.64 44.83,8.59 43.05,6.81 R14.2 45.59,3.49 D5.2 46.74,2.78 46.74,3.76 46.92,3.94 51.31,3.94 51.49,3.76 51.49,2.29 P5.2
VCCSREER4: length 13.2
  Top Layer w0.254: v2(63.87,6.17) 66.71,6.17 D6.2 68.45,4.43 H4.2
  Bottom Layer w0.254: v2(63.87,6.17) 63.87,10.34 v2(62.89,11.32)
(no net):
  vias: v1(3.81,47.58) v1(3.81,3.89) v1(58.55,47.58) v1(58.55,3.89)
EN: length 82.6
  Top Layer w0.762: v2(49.78,38.94) 48.77,39.96 v2(45.34,39.96) ; v2(17.53,29.54) 32.12,29.54 32.4,29.27 32.78,29.27 33.09,28.95 33.09,28.57 v2(33.53,28.13)
  Bottom Layer w0.762: v2(49.78,38.94) 50.16,38.56 v2(50.16,28.51) 50.29,28.64 50.29,29.42 51.18,30.3 65.53,30.3 v2(66.32,29.52) ; v2(33.53,28.13) 36.96,31.56 36.96,34.75 44.3,42.1 S1.2 45.34,45.13 v2(45.34,39.96) ; v2(17.53,29.54) 17.2,29.21 15.29,29.21 15.11,29.03 15.11,28.16 v2(15.09,28.14)
SREER1: length 50.8
  Top Layer w0.254: P3.1 14.22,2.64 v2(14.22,3.89)
  Bottom Layer w0.254: P2.2 24.64,46.05 24.64,14.3 v2(14.22,3.89)
SREER2: length 45.3
  Bottom Layer w0.254: P2.1 31.62,40.34 P4.1
SREER3: length 54.1
  Bottom Layer w0.254: P2.6 32.75,46.83 32.75,44.95 32.51,44.71 32.51,16.72 47.12,2.11 P5.1
SREER4: length 72
  Top Layer w0.254: v2(35.05,45.93) 32.13,45.93 P2.5
  Bottom Layer w0.254: H4.1 46.86,21.16 46.86,49.23 46.61,49.48 38.61,49.48 v2(35.05,45.93)
$1N1529: length 3.3
  Top Layer w0.254: 21.96,44.87 21.97,44.88 21.97,46.72 R25.1
$1N2246: length 3.5
  Top Layer w0.762: 16.38,28.91 14.61,30.69 C8.2
$1N2398: length 10.9
  Top Layer w0.508: 19.43,23.57 18.18,22.32 U1.8 ; 19.69,24.02 19.69,22.18 16.78,19.27 L1.1
$1N2414: length 3.6
  Top Layer w0.508: U1.1 19.69,26.09 C1.2
$1N2467: length 17.6
  Top Layer w0.508: C5.1 18.8,10.47 L1.2 9.72,10.8 C3.2 9.65,10.55 D1.1
$1N2570: length 3
  Top Layer w0.508: R9.2 13.82,28.15 U1.4
$1N2627: length 2.7
  Top Layer w0.508: R5.1 5.27,26.09 C9.2
$1N2629: length 11.7
  Top Layer w0.508: U1.6 15.09,22.03 14.1,21.03 10.03,21.03 7.37,23.7 7.37,25.13 R5.2
$1N2753: length 8.4
  Top Layer w0.254: 3.17,12.69 2.83,12.69 1.52,11.38 1.52,8.84 2.67,7.7 R2.1
$1N2844: length 11.3
  Top Layer w0.254: v2(9.78,24.34) 10.81,25.36 11.15,25.36 ; v2(7.11,22.43) 6.35,21.67 R7.1
  Top Layer w0.508: U1.5 13.82,22.69 R11.2
  Bottom Layer w0.254: v2(9.78,24.34) 9.02,24.34 v2(7.11,22.43)
$1N2877: length 7.6
  Top Layer w0.254: R7.2 R7.3
  Top Layer w0.508: R1.1 6.62,15.81 R7.3
$1N4066: length 9.4
  Top Layer w0.254: R8.1 28.94,24.95 R12.2 31.98,22.32 U2.5
$1N4075: length 3.6
  Top Layer w0.254: 21.59,10.59 21.59,7.36 R4.1
$1N4077: length 7.9
  Top Layer w0.254: R8.2 25.29,16.22 R3.1
$1N4088: length 18.3
  Top Layer w0.254: C6.1 36.83,11.87 L2.2 28.92,10.05 C4.2 27.22,7.33 D2.1
$1N4093: length 25.8
  Top Layer w0.762: C10.2 23.79,32.99 23.79,33.44 23.62,33.61 D4.2 23.62,36.15 25.4,37.92 31.62,37.92 32.64,36.91 C14.1 32.64,32.66 C11.2 34.8,29.1 U2.2
$1N4098: length 7.1
  Top Layer w0.254: C2.1 37.97,24.22 U2.8 36.07,21.31 L2.1
$1N4105: length 3.1
  Top Layer w0.254: C2.2 37.97,26.23 U2.1
$1N4108: length 3.8
  Top Layer w0.254: U2.4 31.76,27.64 28.69,27.64
$1N4117: length 2.2
  Top Layer w0.254: R6.1 22.85,27.32 22.54,27.64
$1N4119: length 11.5
  Top Layer w0.254: v2(28.19,21.67) 28.83,21.03 32.27,21.03 32.84,21.6 32.84,21.63 U2.6 ; v2(25.73,23.95) 25.73,24.67 R6.2
  Bottom Layer w0.254: v2(28.19,21.67) 28.02,21.67 v2(25.73,23.95)
$1N4793: length 18.3
  Top Layer w0.254: D5.1 46.3,7.35 C17.2 46.61,9.35 49.28,12.02 49.28,13.27 51.05,15.05 54.74,11.36 C19.1
$1N4803: length 2.4
  Top Layer w0.254: R17.1 40.7,25.81 C20.2
$1N4807: length 7.5
  Top Layer w0.254: 52.45,22.81 53.28,22.81 C15.1 ; U3.8 52.71,20.8 L3.1
$1N4815: length 29.9
  Top Layer w0.762: U3.2 51.44,30.18 49.95,31.66 C22.2 47.37,33.3 C27.1 47.37,37.42 46.92,37.88 46.92,38.25 46.74,38.43 40,38.43 38.61,37.04 38.61,31.55 C21.2
$1N4820: length 3.6
  Top Layer w0.254: U3.4 47.51,27.13 R21.2
$1N4822: length 3.5
  Top Layer w0.254: U3.1 54.99,26.23 C15.2
$1N4825: length 8.8
  Top Layer w0.254: U3.5 46.49,25.1 v2(45.96,25.1)
  Bottom Layer w0.254: R19.1 45.96,23.94 v2(45.96,25.1)
$1N4831: length 11.4
  Top Layer w0.254: 50.16,22.7 49.47,22.01 49.47,21.98 48.53,21.03 46.74,21.03 44.5,23.27 42.47,23.27 42.29,23.45 42.29,24.91 R17.2
$1N4840: length 3.5
  Top Layer w0.254: R14.1 40.26,6.82 40.26,10.33
$1N4845: length 7.9
  Top Layer w0.254: R19.2 R19.3 44.59,14.92 R13.1
$1N6216: length 8.5
  Top Layer w0.254: R20.2 R20.3 60.89,14.88 R15.1
$1N6219: length 8.9
  Top Layer w0.254: R24.2 v2(63.09,25.67) U4.5
  Bottom Layer w0.254: v2(63.09,25.67) 63.09,24.05 R20.1
$1N6228: length 5.8
  Top Layer w0.254: R16.1 60.07,6.17 58.8,7.44 58.8,8.56 58.04,9.32
$1N6236: length 21.5
  Top Layer w0.254: D6.1 72.14,5.75 72.14,11.51 72.12,11.51 L4.2 67.56,15.57 64.13,12.14 64.13,9.41 C18.2
$1N6243: length 7
  Top Layer w0.254: L4.1 68.86,21.45 U4.8 70.8,23.71 C16.1
$1N6250: length 2.7
  Top Layer w0.254: R18.1 57.04,26.61 56.6,27.05 C26.2
$1N6252: length 10.7
  Top Layer w0.254: R18.2 59.31,25.72 59.31,24.21 61.09,22.43 65.91,22.43 66.09,22.61 66.09,23.48 U4.6
$1N6254: length 29.3
  Top Layer w0.508: 63.12,37.54 C28.1
  Top Layer w0.762: C24.2 55,34.14 D8.2 54.74,35.42 54.74,37.54 57.09,39.89 60.39,39.89 61.97,38.31 61.97,37.54 ; C28.1 63.12,32.67 C25.2 66.84,31.66 67.59,30.92 U4.2
$1N6266: length 3.5
  Top Layer w0.254: U4.4 63.93,28.41 R22.2
$1N6271: length 6.2
  Top Layer w0.254: C16.2 71.5,26.88 U4.1

## Copper pours and planes (outline as drawn; the poured copper is in the pictures)
GND on Top Layer: -0.89,51.51 75.31,51.51 75.31,-1.19 -0.89,-1.19
GND on Bottom Layer: 0.64,50.75 73.67,50.75 73.67,0.52 0.64,0.52
VIN on Top Layer: 3.17,39.03 23.37,39.03 23.62,38.78 38.1,38.78 38.61,39.29 55.5,39.29 55.5,44.66 54.1,46.05 49,46.05 46.08,43.13 45.72,43.13 45.15,42.56 22.66,42.56 21.97,43.24 21.23,42.5 20.51,42.5 16.47,46.55 16,46.55 12.71,43.26 3.17,43.26
$1N2246 on Top Layer: 6.48,30.69 3.13,30.69 3.13,37.62 3.17,37.67 10.38,37.67 10.8,37.25 10.8,34.37 11.68,33.48 14.99,33.48 14.99,30.05 14.73,29.8 13.84,29.8 13.72,29.67 13.72,31.88 7.07,31.88 6.48,32.47

Small or netless copper shapes (teardrops, artwork), in the pictures only: 92 on Top Layer, 18 on Bottom Layer

## Text on the board
Bottom Silkscreen Layer: 2025 | 南京航空航天大学 / 智控天巡
Top Layer: 南京航空航天大学 / 智控天巡 / 2025
Top Silkscreen Layer: CH1 | CH2 | CH3 | CH4 | NO | OFF | + | -
